# Altium schematic sheet soldeerboutmainbody2.SchDoc
size A4; SheetNumber: 2; SheetTotal: 3
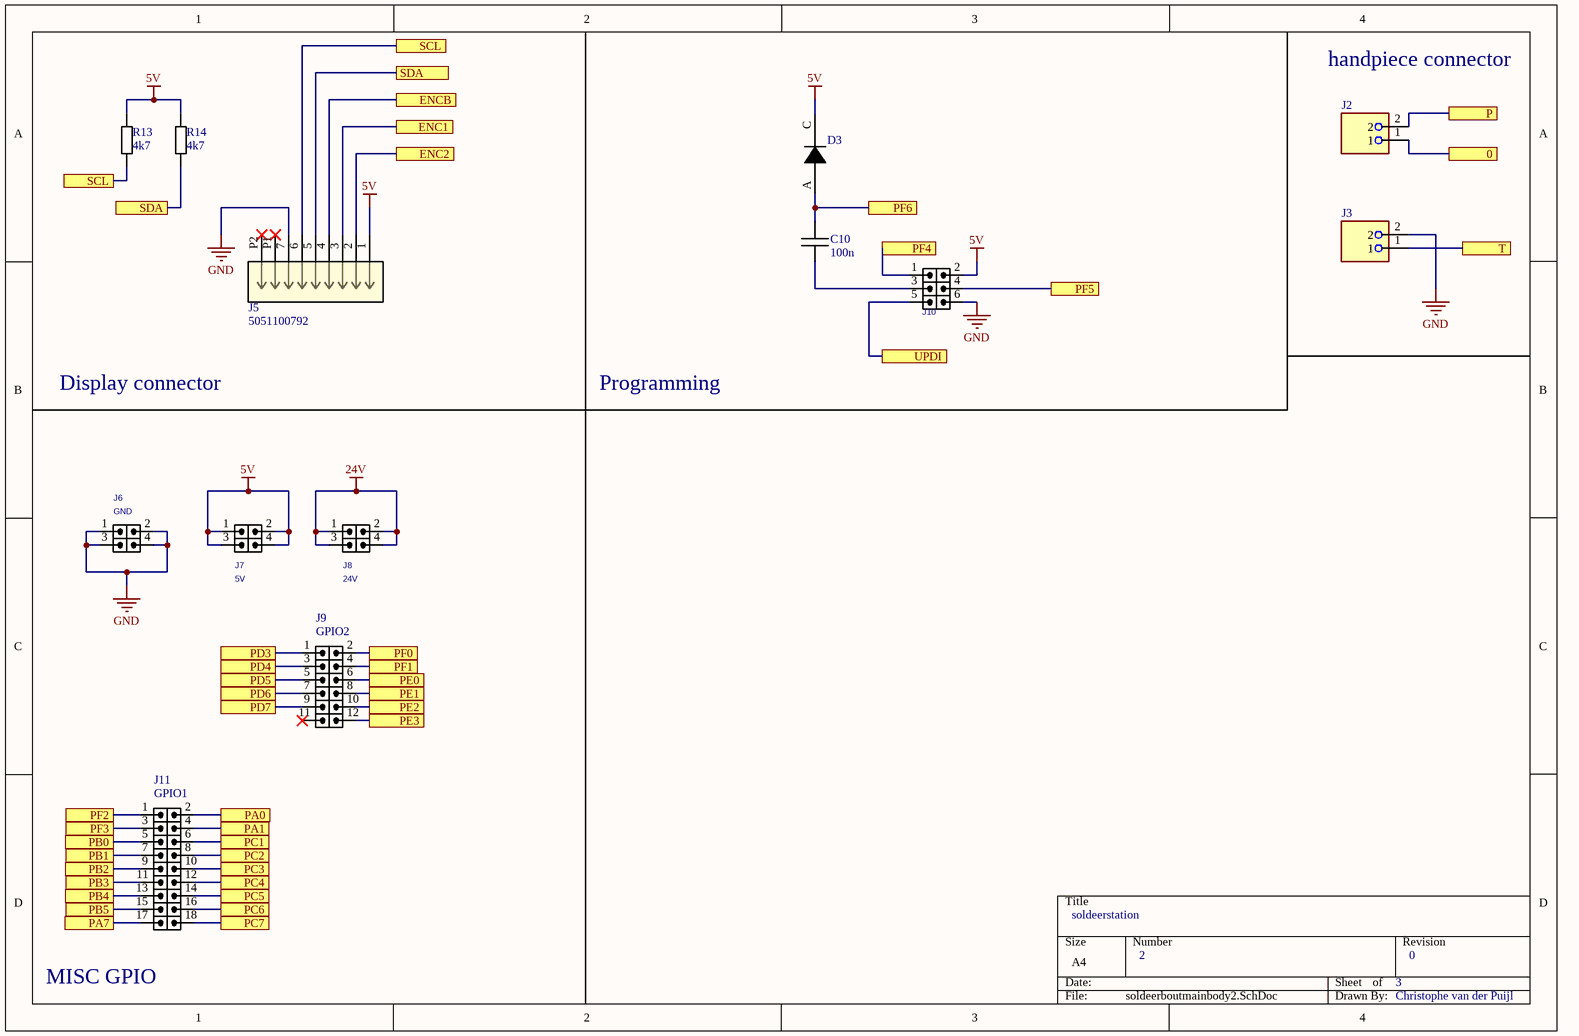
[diagram p0: soldeerboutmainbody2.SchDoc]

## Parts
C10  100n  [C 0603 / 1608]
D3  1N4148WX-TP  [SOD2512X115N]  (value not drawn)
J2  1935161  [PHOENIX_1935161]  (value not drawn)
J3  1935161  [PHOENIX_1935161]  (value not drawn)
J5  5051100792  [CON_5051100792_MOL]
J6  GND  [HDR2_M_2X2]
J7  5V  [HDR2_M_2X2]
J8  24V  [HDR2_M_2X2]
J9  GPIO2  [HDR2_M_2X6]
J10  HDRM_2X3  [HDR2_M_2X3]  (value not drawn)
J11  GPIO1  [HDR2_M_2X9]
R13  4k7  [R 0603]
R14  4k7  [R 0603]

## Ports
0 (see soldeerboutmainbody1[4B]), ENC1 (see soldeerboutmainbody1[1C]), ENC2 (see soldeerboutmainbody1[1C]), ENCB (see soldeerboutmainbody1[1C]), P (see soldeerboutmainbody1[4A]), PA0 (see soldeerboutmainbody1[1C]), PA1 (see soldeerboutmainbody1[1C]), PA7 (see soldeerboutmainbody1[1C]), PB0 (see soldeerboutmainbody1[1C]), PB1 (see soldeerboutmainbody1[1C]), PB2 (see soldeerboutmainbody1[1C]), PB3 (see soldeerboutmainbody1[1C]), PB4 (see soldeerboutmainbody1[1C]), PB5 (see soldeerboutmainbody1[1D]), PC1 (see soldeerboutmainbody1[1D]), PC2 (see soldeerboutmainbody1[1D]), PC3 (see soldeerboutmainbody1[1D]), PC4 (see soldeerboutmainbody1[1D]), PC5 (see soldeerboutmainbody1[1D]), PC6 (see soldeerboutmainbody1[1D]), PC7 (see soldeerboutmainbody1[1D]), PD3 (see soldeerboutmainbody1[3C]), PD4 (see soldeerboutmainbody1[3C]), PD5 (see soldeerboutmainbody1[3C]), PD6 (see soldeerboutmainbody1[3C]), PD7 (see soldeerboutmainbody1[3C]), PE0 (see soldeerboutmainbody1[3C]), PE1 (see soldeerboutmainbody1[3C]), PE2 (see soldeerboutmainbody1[3C]), PE3 (see soldeerboutmainbody1[3C]), PF0 (see soldeerboutmainbody1[3D]), PF1 (see soldeerboutmainbody1[3D]), PF2 (see soldeerboutmainbody1[3D]), PF3 (see soldeerboutmainbody1[3D]), PF4 (see soldeerboutmainbody1[3D]), PF5 (see soldeerboutmainbody1[3D]), PF6 (see soldeerboutmainbody1[3D]), SCL (see soldeerboutmainbody1[1C], soldeerboutmainbody2[1A]), SCL (see soldeerboutmainbody1[1C], soldeerboutmainbody2[2A]), SDA (see soldeerboutmainbody1[1C], soldeerboutmainbody2[1A]), SDA (see soldeerboutmainbody1[1C], soldeerboutmainbody2[2A]), T (see soldeerboutmainbody1[4C]), UPDI (see soldeerboutmainbody1[3D])

## Nets
5V: D3.C(CATHODE) J5.1 J7.1 J7.2 J7.3 J7.4 J10.2 R13.2 R14.2
24V: J8.1 J8.2 J8.3 J8.4
GND: J3.2 J5.7 J6.1 J6.2 J6.3 J6.4 J10.6
0: J2.1 ; port 0
ENC1: J5.3 ; port ENC1
ENC2: J5.2 ; port ENC2
ENCB: J5.4 ; port ENCB
P: J2.2 ; port P
PA0: J11.2 ; port PA0
PA1: J11.4 ; port PA1
PA7: J11.17 ; port PA7
PB0: J11.5 ; port PB0
PB1: J11.7 ; port PB1
PB2: J11.9 ; port PB2
PB3: J11.11 ; port PB3
PB4: J11.13 ; port PB4
PB5: J11.15 ; port PB5
PC1: J11.6 ; port PC1
PC2: J11.8 ; port PC2
PC3: J11.10 ; port PC3
PC4: J11.12 ; port PC4
PC5: J11.14 ; port PC5
PC6: J11.16 ; port PC6
PC7: J11.18 ; port PC7
PD3: J9.1 ; port PD3
PD4: J9.3 ; port PD4
PD5: J9.5 ; port PD5
PD6: J9.7 ; port PD6
PD7: J9.9 ; port PD7
PE0: J9.6 ; port PE0
PE1: J9.8 ; port PE1
PE2: J9.10 ; port PE2
PE3: J9.12 ; port PE3
PF0: J9.2 ; port PF0
PF1: J9.4 ; port PF1
PF2: J11.1 ; port PF2
PF3: J11.3 ; port PF3
PF4: J10.1 ; port PF4
PF5: J10.4 ; port PF5
PF6: C10.1 D3.A(ANODE) ; port PF6
SCL: J5.6 R13.1 ; port SCL
SDA: J5.5 R14.1 ; port SDA
T: J3.1 ; port T
UPDI: J10.5 ; port UPDI
NetC10_2: C10.2 J10.3

Not connected (* = marked no-connect by the designer): J5 P1* P2*; J9 11*

## Notes on the sheet
- handpiece connector
- Display connector
- Programming
- soldeerstation
- (near J11) MISC GPIO
- 2
- 3
- 0
- Christophe van der Puijl

## Library data of the parts
C10 = Capacitor
D3 = 1N4148WX-TP: MF: {'manufacturer': u'Micro Commercial'}; Package: None; Price: None; Value: *; MP: 1N4148WX-TP; Availability: Unavailable
J2 J3 = 1935161: MF: {'manufacturer': u'Phoenix Contact'}; Package: None; Price: None; Value: *; MP: 1935161; Availability: Unavailable
J5 = 5051100792: No Description Available; Mfr_Name: Molex Connector Corporation; RefDes: RefDes; Type: Type
J6-J8 = HDRRS_M_2X2: CONN, HEADER, Male, pitch: 2.54mm, 4POS; MANF_P#: MANF_PART#; VALUE: HDRM_2X2; MANF: MANF
J9 = HDRRS_M_2X6: CONN, HEADER, Male, pitch: 2.54mm, 12POS; VALUE: HDRM_2X6
J10 = HDRRS_M_2X3: CONN, HEADER, Male, pitch: 2.54mm, 6POS; MANF_P#: MANF_PART#; MANF: MANF; VALUE: HDRM_2X3
J11 = HDRRS_M_2X9: CONN, HEADER, Male, pitch: 2.54mm, 18POS; VALUE: HDRM_2X9
R13 R14 = Resistor